# EAGLE design dio_adapter (EAGLE 6.5.0)
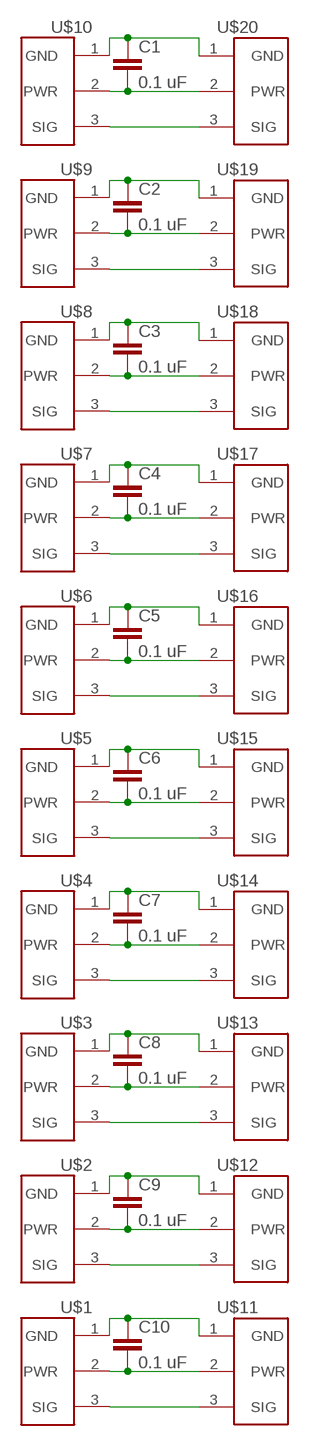
[diagram p0: schematic, sheet 1]

## Parts
C1  0.1 uF  CAP0603  [0603]
C2  0.1 uF  CAP0603  [0603]
C3  0.1 uF  CAP0603  [0603]
C4  0.1 uF  CAP0603  [0603]
C5  0.1 uF  CAP0603  [0603]
C6  0.1 uF  CAP0603  [0603]
C7  0.1 uF  CAP0603  [0603]
C8  0.1 uF  CAP0603  [0603]
C9  0.1 uF  CAP0603  [0603]
C10  0.1 uF  CAP0603  [0603]
U$1  22-23-2031GENERIC  [PWM_1X3]
U$2  22-23-2031GENERIC  [PWM_1X3]
U$3  22-23-2031GENERIC  [PWM_1X3]
U$4  22-23-2031GENERIC  [PWM_1X3]
U$5  22-23-2031GENERIC  [PWM_1X3]
U$6  22-23-2031GENERIC  [PWM_1X3]
U$7  22-23-2031GENERIC  [PWM_1X3]
U$8  22-23-2031GENERIC  [PWM_1X3]
U$9  22-23-2031GENERIC  [PWM_1X3]
U$10  22-23-2031GENERIC  [PWM_1X3]
U$11  22-23-2031  [22-23-2031]
U$12  22-23-2031  [22-23-2031]
U$13  22-23-2031  [22-23-2031]
U$14  22-23-2031  [22-23-2031]
U$15  22-23-2031  [22-23-2031]
U$16  22-23-2031  [22-23-2031]
U$17  22-23-2031  [22-23-2031]
U$18  22-23-2031  [22-23-2031]
U$19  22-23-2031  [22-23-2031]
U$20  22-23-2031  [22-23-2031]

## Nets
N$1: C1.1 U$10.1(GND) U$20.1(GND)
N$2: C1.2 U$10.2(PWR) U$20.2(PWR)
N$3: U$10.3(SIG) U$20.3(SIG)
N$4: C10.1 U$1.1(GND) U$11.1(GND)
N$5: C2.2 U$9.2(PWR) U$19.2(PWR)
N$6: U$9.3(SIG) U$19.3(SIG)
N$7: C9.1 U$2.1(GND) U$12.1(GND)
N$8: C3.2 U$8.2(PWR) U$18.2(PWR)
N$9: U$8.3(SIG) U$18.3(SIG)
N$10: C8.1 U$3.1(GND) U$13.1(GND)
N$11: C4.2 U$7.2(PWR) U$17.2(PWR)
N$12: U$7.3(SIG) U$17.3(SIG)
N$13: C7.1 U$4.1(GND) U$14.1(GND)
N$14: C5.2 U$6.2(PWR) U$16.2(PWR)
N$15: U$6.3(SIG) U$16.3(SIG)
N$16: C6.1 U$5.1(GND) U$15.1(GND)
N$17: C6.2 U$5.2(PWR) U$15.2(PWR)
N$18: U$5.3(SIG) U$15.3(SIG)
N$19: C5.1 U$6.1(GND) U$16.1(GND)
N$20: C7.2 U$4.2(PWR) U$14.2(PWR)
N$21: U$4.3(SIG) U$14.3(SIG)
N$22: C4.1 U$7.1(GND) U$17.1(GND)
N$23: C8.2 U$3.2(PWR) U$13.2(PWR)
N$24: U$3.3(SIG) U$13.3(SIG)
N$25: C3.1 U$8.1(GND) U$18.1(GND)
N$26: C9.2 U$2.2(PWR) U$12.2(PWR)
N$27: U$2.3(SIG) U$12.3(SIG)
N$28: C2.1 U$9.1(GND) U$19.1(GND)
N$29: C10.2 U$1.2(PWR) U$11.2(PWR)
N$30: U$1.3(SIG) U$11.3(SIG)

## Library data of the parts
C1-C10 = custom:CAP: Capacitor Standard 0603 ceramic capacitor, and 0.1" leaded capacitor.
U$1-U$20 = custom:22-23-2031: Molex 3-pin male connector 22-23-2031.

## Board
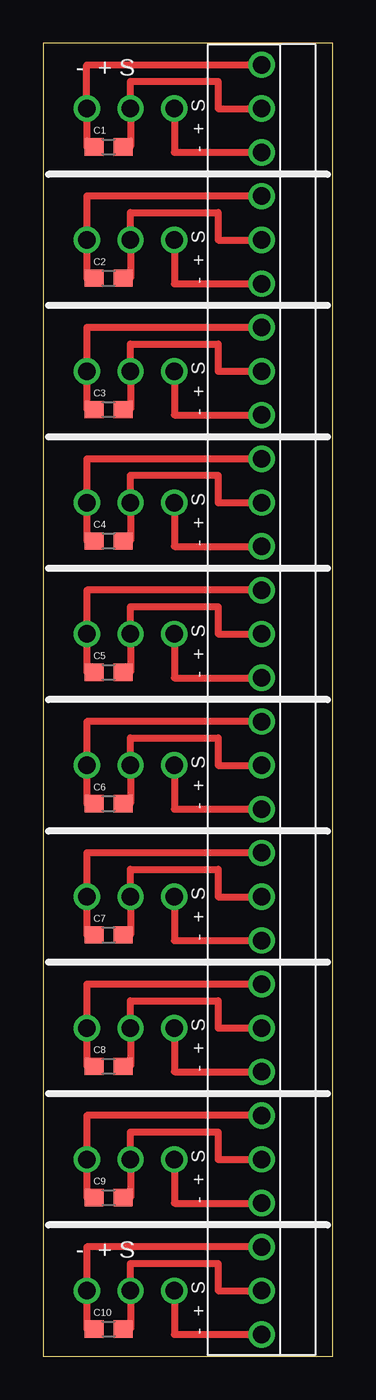
[diagram p1: board, top side]
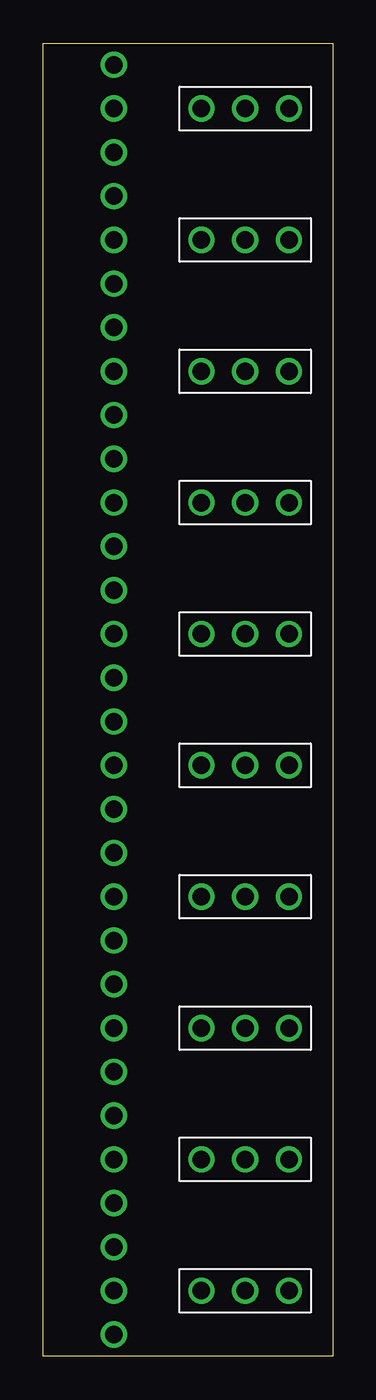
[diagram p2: board, bottom side, seen from below]

Size 16.82 x 76.19 mm. Coordinates in mm from the lower left corner, seen from the top.
Outline: 0,0 16.82,0 16.82,76.19 0,76.19 0,0
Copper layers (1*16): Top 0.035mm / dielectric 1.5mm / Bottom 0.035mm
Design rules "SeeedStudio_2layer_DRU_no_angle_20140221 *": minimum track width 6mil, minimum drill 12mil, track to track 6mil, track to pad 6mil, pad to pad 6mil, via to via 6mil, smd to smd 0mil, copper to edge 10mil, drill to drill 10mil, minimum pad ring 10mil, minimum via ring 6mil, stop-mask expansion 2mil, vias tented up to drill 100mil, thermal gap 10mil

### Footprints (pad centres in the part's own frame; a part is rotated, then mirrored left to right if it is on the bottom)
0603 = smd 1.1 x 1: 1 -0.85,0; 2 0.85,0
PWM_1X3 = drill 1.016: 1 0,2.54; 2 0,0; 3 0,-2.54
22-23-2031 = drill 1.016: 1 0,2.54; 2 0,0; 3 0,-2.54

### Placement (x,y rotation side)
C1  3.81,70.17 0 top
C2  3.81,62.55 0 top
C3  3.81,54.93 0 top
C4  3.81,47.31 0 top
C5  3.81,39.69 0 top
C6  3.81,32.07 0 top
C7  3.81,24.45 0 top
C8  3.81,16.83 0 top
C9  3.81,9.21 0 top
C10  3.81,1.59 0 top
U$1  5.08,3.81 270 bottom
U$2  5.08,11.43 270 bottom
U$3  5.08,19.05 270 bottom
U$4  5.08,26.67 270 bottom
U$5  5.08,34.29 270 bottom
U$6  5.08,41.91 270 bottom
U$7  5.08,49.53 270 bottom
U$8  5.08,57.15 270 bottom
U$9  5.08,64.77 270 bottom
U$10  5.08,72.39 270 bottom
U$11  12.7,3.81 0 top
U$12  12.7,11.43 0 top
U$13  12.7,19.05 0 top
U$14  12.7,26.67 0 top
U$15  12.7,34.29 0 top
U$16  12.7,41.91 0 top
U$17  12.7,49.53 0 top
U$18  12.7,57.15 0 top
U$19  12.7,64.77 0 top
U$20  12.7,72.39 0 top

### Tracks (layer width: path | path; a pad name or v marks a point on that pad's centre or on a via)
N$1
  Top 0.406: U$20.1 2.54,74.93 U$10.1 2.54,70.17 C1.1
N$2
  Top 0.406: U$20.2 10.16,72.39 10.16,73.98 5.08,73.98 U$10.2 5.08,70.17 C1.2
N$3
  Top 0.406: U$10.3 7.62,69.85 U$20.3
N$4
  Top 0.406: U$11.1 2.54,6.35 U$1.1 2.54,1.59 C10.1
N$5
  Top 0.406: U$19.2 10.16,64.77 10.16,66.36 5.08,66.36 U$9.2 5.08,62.55 C2.2
N$6
  Top 0.406: U$9.3 7.62,62.23 U$19.3
N$7
  Top 0.406: U$12.1 2.54,13.97 U$2.1 2.54,9.21 C9.1
N$8
  Top 0.406: U$18.2 10.16,57.15 10.16,58.74 5.08,58.74 U$8.2 5.08,54.93 C3.2
N$9
  Top 0.406: U$8.3 7.62,54.61 U$18.3
N$10
  Top 0.406: U$13.1 2.54,21.59 U$3.1 2.54,16.83 C8.1
N$11
  Top 0.406: U$17.2 10.16,49.53 10.16,51.12 5.08,51.12 U$7.2 5.08,47.31 C4.2
N$12
  Top 0.406: U$7.3 7.62,46.99 U$17.3
N$13
  Top 0.406: U$14.1 2.54,29.21 U$4.1 2.54,24.45 C7.1
N$14
  Top 0.406: U$16.2 10.16,41.91 10.16,43.5 5.08,43.5 U$6.2 5.08,39.69 C5.2
N$15
  Top 0.406: U$6.3 7.62,39.37 U$16.3
N$16
  Top 0.406: U$15.1 2.54,36.83 U$5.1 2.54,32.07 C6.1
N$17
  Top 0.406: U$15.2 10.16,34.29 10.16,35.88 5.08,35.88 U$5.2 5.08,32.07 C6.2
N$18
  Top 0.406: U$5.3 7.62,31.75 U$15.3
N$19
  Top 0.406: U$16.1 2.54,44.45 U$6.1 2.54,39.69 C5.1
N$20
  Top 0.406: U$14.2 10.16,26.67 10.16,28.26 5.08,28.26 U$4.2 5.08,24.45 C7.2
N$21
  Top 0.406: U$4.3 7.62,24.13 U$14.3
N$22
  Top 0.406: U$17.1 2.54,52.07 U$7.1 2.54,47.31 C4.1
N$23
  Top 0.406: U$13.2 10.16,19.05 10.16,20.64 5.08,20.64 U$3.2 5.08,16.83 C8.2
N$24
  Top 0.406: U$3.3 7.62,16.51 U$13.3
N$25
  Top 0.406: U$18.1 2.54,59.69 U$8.1 2.54,54.93 C3.1
N$26
  Top 0.406: U$12.2 10.16,11.43 10.16,13.02 5.08,13.02 U$2.2 5.08,9.21 C9.2
N$27
  Top 0.406: U$2.3 7.62,8.89 U$12.3
N$28
  Top 0.406: U$19.1 2.54,67.31 U$9.1 2.54,62.55 C2.1
N$29
  Top 0.406: U$11.2 10.16,3.81 10.16,5.4 5.08,5.4 U$1.2 5.08,1.59 C10.2
N$30
  Top 0.406: U$1.3 7.62,1.27 U$11.3

### Text on the board
tPlace: - + S | - + S | - + S | - + S | - + S | - + S | - + S | - + S | - + S | - + S | - + S | - + S